# EAGLE design PidiPC (EAGLE 9.2.0)
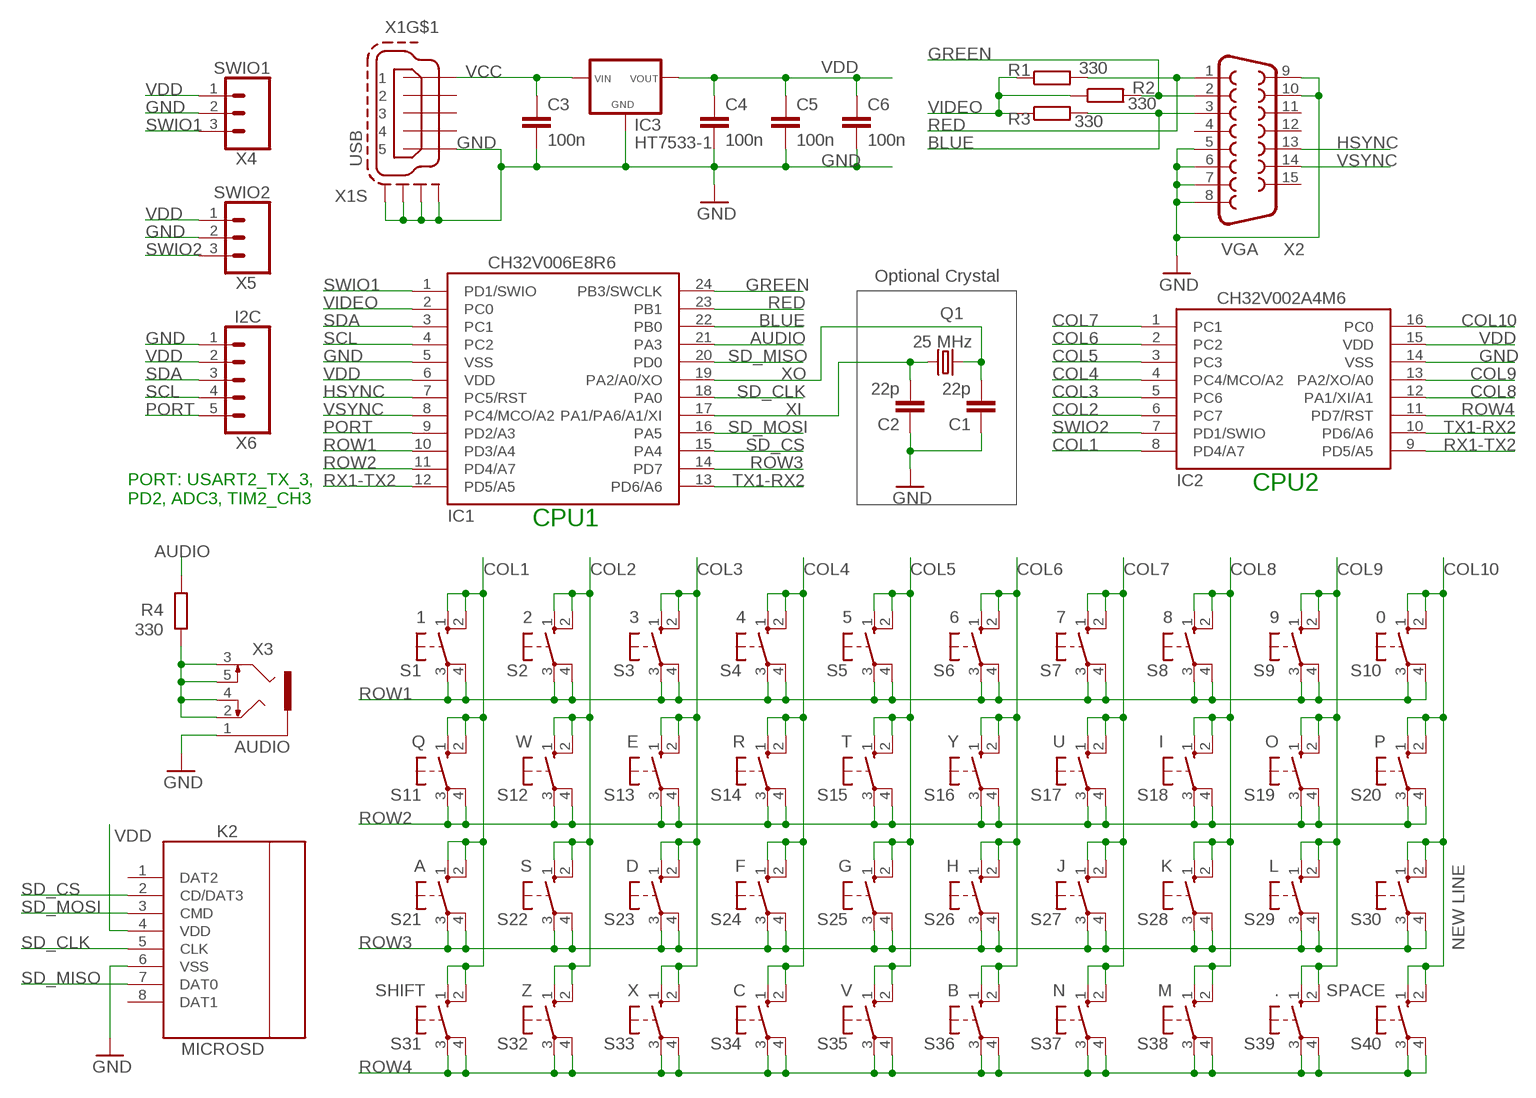
[diagram p0: schematic, sheet 1]

## Parts
C1  22p  C-EU050-024X044  [C050-024X044]
C2  22p  C-EU050-024X044  [C050-024X044]
C3  100n  C-EU050-024X044  [C050-024X044]
C4  100n  C-EU050-024X044  [C050-024X044]
C5  100n  C-EU050-024X044  [C050-024X044]
C6  100n  C-EU050-024X044  [C050-024X044]
IC1  CH32V006E8R6  [QSOP24]
IC2  CH32V002A4M6  [SOP16]
IC3  HT7533-1  [HT7533-1]
K2  MICROSD  [MICROSD]
Q1  25 MHz  CRYSTALHC49U-V  [HC49U-V]
R1  330  R-EU_0204/7  [0204/7]
R2  330  R-EU_0204/7  [0204/7]
R3  330  R-EU_0204/7  [0204/7]
R4  330  R-EU_0204/7  [0204/7]
S1  1  10-XX  [B3F-10XX]
S2  2  10-XX  [B3F-10XX]
S3  3  10-XX  [B3F-10XX]
S4  4  10-XX  [B3F-10XX]
S5  5  10-XX  [B3F-10XX]
S6  6  10-XX  [B3F-10XX]
S7  7  10-XX  [B3F-10XX]
S8  8  10-XX  [B3F-10XX]
S9  9  10-XX  [B3F-10XX]
S10  0  10-XX  [B3F-10XX]
S11  Q  10-XX  [B3F-10XX]
S12  W  10-XX  [B3F-10XX]
S13  E  10-XX  [B3F-10XX]
S14  R  10-XX  [B3F-10XX]
S15  T  10-XX  [B3F-10XX]
S16  Y  10-XX  [B3F-10XX]
S17  U  10-XX  [B3F-10XX]
S18  I  10-XX  [B3F-10XX]
S19  O  10-XX  [B3F-10XX]
S20  P  10-XX  [B3F-10XX]
S21  A  10-XX  [B3F-10XX]
S22  S  10-XX  [B3F-10XX]
S23  D  10-XX  [B3F-10XX]
S24  F  10-XX  [B3F-10XX]
S25  G  10-XX  [B3F-10XX]
S26  H  10-XX  [B3F-10XX]
S27  J  10-XX  [B3F-10XX]
S28  K  10-XX  [B3F-10XX]
S29  L  10-XX  [B3F-10XX]
S30  NEW LINE  10-XX  [B3F-10XX]
S31  SHIFT  10-XX  [B3F-10XX]
S32  Z  10-XX  [B3F-10XX]
S33  X  10-XX  [B3F-10XX]
S34  C  10-XX  [B3F-10XX]
S35  V  10-XX  [B3F-10XX]
S36  B  10-XX  [B3F-10XX]
S37  N  10-XX  [B3F-10XX]
S38  M  10-XX  [B3F-10XX]
S39  .  10-XX  [B3F-10XX]
S40  SPACE  10-XX  [B3F-10XX]
X1  USB  MINI-USB-SCHIELD-32005-201  [32005-201]
X2  VGA  F15HDH  [HDF15H]
X3  AUDIO  1503_09  [1503_09]
X4  SWIO1  CONN_03LONGPADS  [1X03_LONGPADS]
X5  SWIO2  CONN_03LONGPADS  [1X03_LONGPADS]
X6  I2C  CONN_05PTH_LONGPADS  [1X05_LONGPADS]

## Nets
AUDIO: IC1.21(PA3) R4.2
BLUE: IC1.22(PB0) R3.2 X2.3
COL1: IC2.8(PD4/A7) S1.1(S) S1.2(S1) S11.1(S) S11.2(S1) S21.1(S) S21.2(S1) S31.1(S) S31.2(S1)
COL2: IC2.6(PC7) S2.1(S) S2.2(S1) S12.1(S) S12.2(S1) S22.1(S) S22.2(S1) S32.1(S) S32.2(S1)
COL3: IC2.5(PC6) S3.1(S) S3.2(S1) S13.1(S) S13.2(S1) S23.1(S) S23.2(S1) S33.1(S) S33.2(S1)
COL4: IC2.4(PC4/MCO/A2) S4.1(S) S4.2(S1) S14.1(S) S14.2(S1) S24.1(S) S24.2(S1) S34.1(S) S34.2(S1)
COL5: IC2.3(PC3) S5.1(S) S5.2(S1) S15.1(S) S15.2(S1) S25.1(S) S25.2(S1) S35.1(S) S35.2(S1)
COL6: IC2.2(PC2) S6.1(S) S6.2(S1) S16.1(S) S16.2(S1) S26.1(S) S26.2(S1) S36.1(S) S36.2(S1)
COL7: IC2.1(PC1) S7.1(S) S7.2(S1) S17.1(S) S17.2(S1) S27.1(S) S27.2(S1) S37.1(S) S37.2(S1)
COL8: IC2.12(PA1/XI/A1) S8.1(S) S8.2(S1) S18.1(S) S18.2(S1) S28.1(S) S28.2(S1) S38.1(S) S38.2(S1)
COL9: IC2.13(PA2/XO/A0) S9.1(S) S9.2(S1) S19.1(S) S19.2(S1) S29.1(S) S29.2(S1) S39.1(S) S39.2(S1)
COL10: IC2.16(PC0) S10.1(S) S10.2(S1) S20.1(S) S20.2(S1) S30.1(S) S30.2(S1) S40.1(S) S40.2(S1)
GND: C1.1 C2.1 C3.2 C4.2 C5.2 C6.2 IC1.5(VSS) IC2.14(VSS) IC3.GND K2.6(VSS) X1.5 X1.M1(S:S1) X1.M2(S:S2) X1.M3(S:S3) X1.M4(S:S4) X2.5 X2.6 X2.7 X2.8 X2.9 X2.10 X3.1 X4.2 X5.2 X6.1
GREEN: IC1.24(PB3/SWCLK) R2.2 X2.2
HSYNC: IC1.7(PC5/RST) X2.13
N$7: R4.1 X3.2 X3.3 X3.4 X3.5
PORT: IC1.9(PD2/A3) X6.5
RED: IC1.23(PB1) R1.2 X2.1
ROW1: IC1.10(PD3/A4) S1.3(P) S1.4(P1) S2.3(P) S2.4(P1) S3.3(P) S3.4(P1) S4.3(P) S4.4(P1) S5.3(P) S5.4(P1) S6.3(P) S6.4(P1) S7.3(P) S7.4(P1) S8.3(P) S8.4(P1) S9.3(P) S9.4(P1) S10.3(P) S10.4(P1)
ROW2: IC1.11(PD4/A7) S11.3(P) S11.4(P1) S12.3(P) S12.4(P1) S13.3(P) S13.4(P1) S14.3(P) S14.4(P1) S15.3(P) S15.4(P1) S16.3(P) S16.4(P1) S17.3(P) S17.4(P1) S18.3(P) S18.4(P1) S19.3(P) S19.4(P1) S20.3(P) S20.4(P1)
ROW3: IC1.14(PD7) S21.3(P) S21.4(P1) S22.3(P) S22.4(P1) S23.3(P) S23.4(P1) S24.3(P) S24.4(P1) S25.3(P) S25.4(P1) S26.3(P) S26.4(P1) S27.3(P) S27.4(P1) S28.3(P) S28.4(P1) S29.3(P) S29.4(P1) S30.3(P) S30.4(P1)
ROW4: IC2.11(PD7/RST) S31.3(P) S31.4(P1) S32.3(P) S32.4(P1) S33.3(P) S33.4(P1) S34.3(P) S34.4(P1) S35.3(P) S35.4(P1) S36.3(P) S36.4(P1) S37.3(P) S37.4(P1) S38.3(P) S38.4(P1) S39.3(P) S39.4(P1) S40.3(P) S40.4(P1)
RX1-TX2: IC1.12(PD5/A5) IC2.9(PD5/A5)
SCL: IC1.4(PC2) X6.4
SD_CLK: IC1.18(PA0) K2.5(CLK)
SD_CS: IC1.15(PA4) K2.2(CD/DAT3)
SD_MISO: IC1.20(PD0) K2.7(DAT0)
SD_MOSI: IC1.16(PA5) K2.3(CMD)
SDA: IC1.3(PC1) X6.3
SWIO1: IC1.1(PD1/SWIO) X4.3
SWIO2: IC2.7(PD1/SWIO) X5.3
TX1-RX2: IC1.13(PD6/A6) IC2.10(PD6/A6)
VCC: C3.1 IC3.VIN X1.1
VDD: C4.1 C5.1 C6.1 IC1.6(VDD) IC2.15(VDD) IC3.VOUT K2.4(VDD) X4.1 X5.1 X6.2
VIDEO: IC1.2(PC0) R1.1 R2.1 R3.1
VSYNC: IC1.8(PC4/MCO/A2) X2.14
XI: C2.2 IC1.17(PA1/PA6/A1/XI) Q1.2
XO: C1.2 IC1.19(PA2/A0/XO) Q1.1
Unconnected: K2.1(DAT2) K2.8(DAT1) X1.2 X1.3 X1.4 X2.4 X2.11 X2.12 X2.15

## Notes on the sheet
- Optional Crystal
- CPU2
- PORT: USART2_TX_3,
  PD2, ADC3, TIM2_CH3
- CPU1

## Library data of the parts
C1-C6 = rcl:C-EU: CAPACITOR, European symbol; SPICEPREFIX: C
IC1 = CH32V:CH32V006E8R6
IC2 = CH32V:CH32V002A4M6
IC3 = HT7533-1B:HT7533-1
K2 = Wuerth_Elektronik_eiCan_Communication_Connectors_v2.2:MICROSD: WR-CRD MICRO SD CARD CONNECTOR HINGE 8PINS
Q1 = crystal:CRYSTAL: CRYSTAL; OC_FARNELL: 1666969; OC_NEWARK: unknown
R1-R4 = rcl:R-EU_: RESISTOR, European symbol; SPICEPREFIX: R
S1-S40 = switch-omron2:10-XX: OMRON SWITCH; MPN: B3F-1000; OC_FARNELL: 176432; OC_NEWARK: 36M3542
X1 = con-cypressindustries:MINI-USB-SCHIELD-: MINI USB-B Conector Source: www.cypressindustries.com; OC_FARNELL: unknown; OC_NEWARK: unknown
X2 = adafruit_B:F15: SUB-D HDH is also known as a 'right angle VGA' connector
X3 = con-lumberg:1503_09: Jack connectors according to JISC 6560, 3.5 mm Klinkeneinbaukupplung nach JISC 6560, 3,5 mm, 3-polig/ stereo, abgewinkelte Ausführung, mit 2 Öffnern und Lötaugen, für Leiterplatten Rückseitenmontage Source: http://www.lumberg.com/Produkte/PDFs/1503_09.pdf; OC_FARNELL: 1243244; OC_NEWARK: unknown
X4 X5 = SparkFun-Connectors:CONN_03: Multi connection point. Often used as Generic Header-pin footprint for 0.1 inch spaced/style header connections On any of the 0.1 inch spaced packages, you can populate with these: Break Away Headers - Straight <https://www.sparkfun.com/products/116> (PRT-00116) Break Away Male Headers - Right Angle <https://www.sparkfun.com/products/553> (PRT-00553) Female Headers <https://www.sparkfun.com/products/115> (PRT-00115) Break Away Headers - Machine Pin <https://www.sparkfun.com/products/117> (PRT-00117) Break Away Female Headers - Swiss Machine Pin <https://www.sparkfun.com/products/743> (PRT-00743) Stackable Header - 3 Pin (Female, 0.1") <https://www.sparkfun.com/products/13875> (PRT-13875) For SCREWTERMINALS and SPRING TERMINALS visit here: Screw Terimnals on SparkFun.com <https://www.sparkfun.com/search/results?term=Screw+Terminals> (5mm/3.5mm/2.54mm spacing) This device is also useful as a general connection point to wire up your design to another part of your project. Our various solder wires solder well into these plated through hole pads. Hook-Up Wire - Assortment (Stranded, 22 AWG) <https://www.sparkfun.com/products/11375> (PRT-11375) Hook-Up Wire - Assortment (Solid Core, 22 AWG) <https://www.sparkfun.com/products/11367> (PRT-11367) View the entire wire category on our website here <https://www.sparkfun.com/categories/141> Special notes: Molex polarized connector foot print use with SKU : PRT-08232 with associated crimp pins and housings.
X6 = SparkFun-Connectors:CONN_05: Multi connection point. Often used as Generic Header-pin footprint for 0.1 inch spaced/style header connections On any of the 0.1 inch spaced packages, you can populate with these: Break Away Headers - Straight <https://www.sparkfun.com/products/116> (PRT-00116) Break Away Male Headers - Right Angle <https://www.sparkfun.com/products/553> (PRT-00553) Female Headers <https://www.sparkfun.com/products/115> (PRT-00115) Break Away Headers - Machine Pin <https://www.sparkfun.com/products/117> (PRT-00117) Break Away Female Headers - Swiss Machine Pin <https://www.sparkfun.com/products/743> (PRT-00743) For SCREWTERMINALS and SPRING TERMINALS visit here: Screw Terimnals on SparkFun.com <https://www.sparkfun.com/search/results?term=Screw+Terminals> (5mm/3.5mm/2.54mm spacing) This device is also useful as a general connection point to wire up your design to another part of your project. Our various solder wires solder well into these plated through hole pads. Hook-Up Wire - Assortment (Stranded, 22 AWG) <https://www.sparkfun.com/products/11375> (PRT-11375) Hook-Up Wire - Assortment (Solid Core, 22 AWG) <https://www.sparkfun.com/products/11367> (PRT-11367) View the entire wire category on our website here <https://www.sparkfun.com/categories/141> Special notes: Molex polarized connector foot print use with SKU : PRT-08231 with associated crimp pins and housings. 1MM SMD Version SKU: PRT-10208

## Board
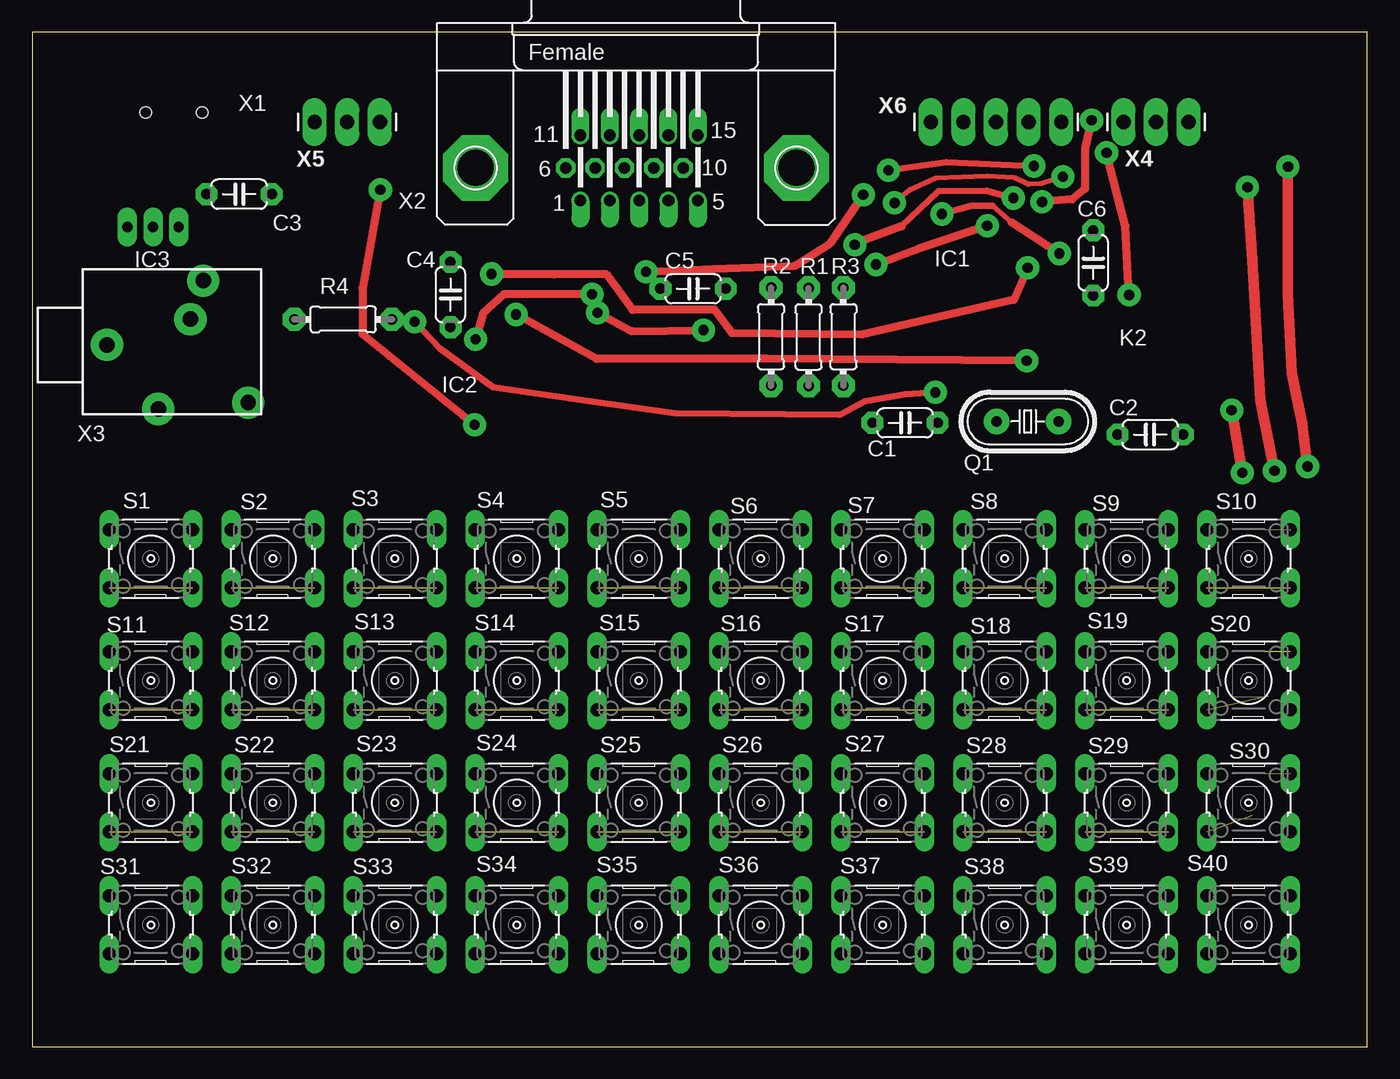
[diagram p1: board, top side]
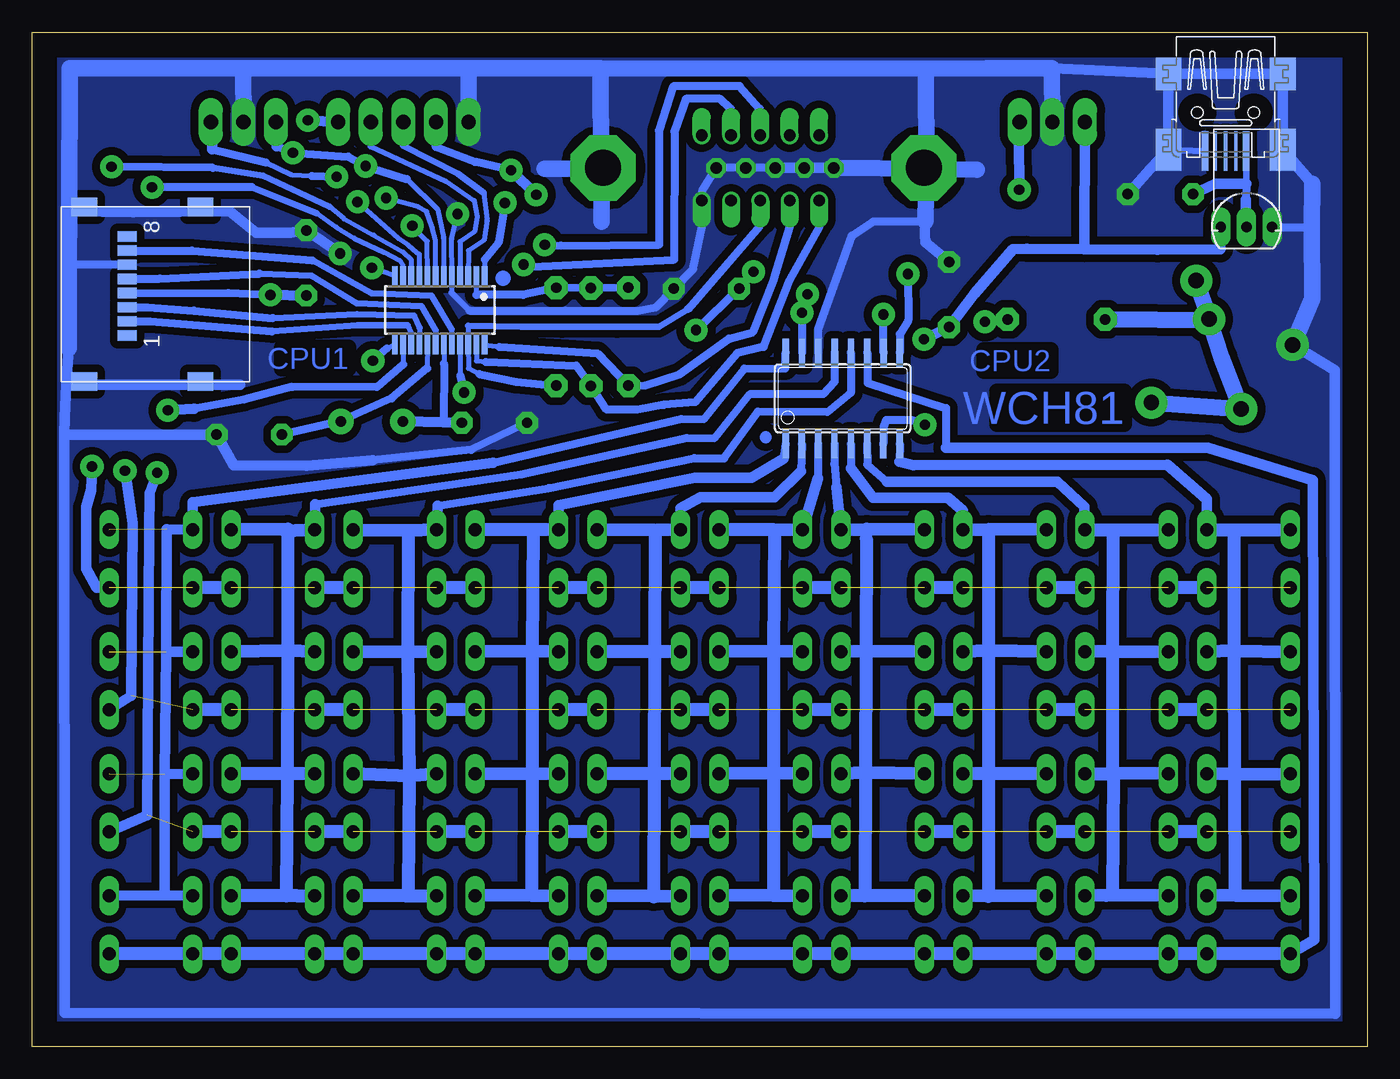
[diagram p2: board, bottom side, seen from below]

Size 104 x 79 mm. Coordinates in mm from the lower left corner, seen from the top.
Outline: 0,0 104,0 104,79 0,79 0,0
Copper layers (1*16): Top 0.035mm / dielectric 1.5mm / Bottom 0.035mm
Design rules "default": minimum track width 6mil, minimum drill 0.35mm, track to track 6mil, track to pad 6mil, pad to pad 6mil, via to via 6mil, smd to smd 6mil, copper to edge 40mil, drill to drill 6mil, minimum pad ring 10mil, minimum via ring 8mil, stop-mask expansion 4mil, vias tented up to drill 0mil, thermal gap 10mil

### Footprints (pad centres in the part's own frame; a part is rotated, then mirrored left to right if it is on the bottom)
C050-024X044 = drill 0.813 pad 1.7 octagon: 1 -2.54,0; 2 2.54,0
QSOP24 = smd 0.45 x 1.5: 1 -3.493,-2.69; 2 -2.857,-2.69; 3 -2.223,-2.69; 4 -1.587,-2.69; 5 -0.953,-2.69; 6 -0.318,-2.69; 7 0.318,-2.69; 8 0.953,-2.69; 9 1.587,-2.69; 10 2.223,-2.69; 11 2.857,-2.69; 12 3.493,-2.69; 13 3.493,2.69; 14 2.857,2.69; 15 2.223,2.69; 16 1.587,2.69; 17 0.953,2.69; 18 0.318,2.69; 19 -0.318,2.69; 20 -0.953,2.69; 21 -1.587,2.69; 22 -2.223,2.69; 23 -2.857,2.69; 24 -3.493,2.69
SOP16 = smd 0.5 x 2.2: 1 -4.445,-3.55; 2 -3.185,-3.55; 3 -1.915,-3.55; 4 -0.645,-3.55; 5 0.635,-3.55; 6 1.895,-3.55; 7 3.165,-3.55; 8 4.435,-3.55; 9 4.445,3.55; 10 3.175,3.55; 11 1.905,3.55; 12 0.635,3.55; 13 -0.635,3.55; 14 -1.905,3.55; 15 -3.175,3.55; 16 -4.445,3.55
HT7533-1 = drill 0.8 pad 1.5 long: GND 2,0; VIN 0,0; VOUT -2,0
MICROSD = smd 0.8 x 1.5: 1 2.62,-2.54; 2 1.52,-2.54; 3 0.42,-2.54; 4 -0.68,-2.54; 5 -1.78,-2.54; 6 -2.88,-2.54; 7 -3.98,-2.54; 8 -5.08,-2.54 | smd 1.45 x 2: Z1 -7.38,3.16; Z2 6.22,3.16; Z3 -7.38,-5.89; Z4 6.22,-5.89
HC49U-V = drill 0.813 pad 2: 1 -2.413,0; 2 2.413,0
0204/7 = drill 0.813 pad 1.8 octagon: 1 -3.81,0; 2 3.81,0
B3F-10XX = drill 1.016 long: 1 -3.251,2.261; 2 3.251,2.261; 3 -3.251,-2.261; 4 3.251,-2.261
32005-201 = smd 3.1 x 0.5: 1 3,1.6; 5 3,-1.6 | smd 3.1 x 0.254: 2 3,0.8; 3 3,0; 4 3,-0.8 | smd 2.5 x 2: M1 -3,-4.45; M2 -3,4.45 | smd 3.3 x 2: M3 2.9,4.45; M4 2.9,-4.45 | hole 0.9: 0,2.2; 0,-2.2
HDF15H = drill 0.9 pad 1.27 offset: 1 4.329,2.54; 2 2.043,2.54; 3 -0.243,2.54; 4 -2.529,2.54; 5 -4.815,2.54; 11 4.329,-2.54; 12 2.043,-2.54; 13 -0.243,-2.54; 14 -2.529,-2.54; 15 -4.815,-2.54 | drill 0.9 pad 1.5 octagon: 6 5.472,0; 7 3.186,0; 8 0.9,0; 9 -1.386,0; 10 -3.672,0 | drill 2.8 pad 5.08 octagon: P$1 -12.5,0; P$2 12.5,0
1503_09 = drill 1.2 pad 2.5: 1 0,-2; 2 -5,-6; 3 5,-9.5; 4 -4.5,-13; 5 2,-8.5
1X03_LONGPADS = drill 1.118 pad 1.88 long: 1 0,0; 2 2.54,0; 3 5.08,0
1X05_LONGPADS = drill 1.118 pad 1.88 long: 1 0,0; 2 2.54,0; 3 5.08,0; 4 7.62,0; 5 10.16,0

### Placement (x,y rotation side)
C1  67.99,48.58 0 top
C2  87.09,47.67 180 top
C3  16.12,66.39 0 top
C4  32.58,58.57 90 top
C5  51.48,59.02 0 top
C6  82.64,61.03 90 top
IC1  72.26,57.35 180 bottom
IC2  40.86,50.49 0 bottom
IC3  9.42,63.82 0 bottom
K2  94.05,58.01 270 bottom
Q1  77.54,48.69 0 top
R1  60.47,55.26 270 top
R2  57.55,55.29 270 top
R3  63.19,55.29 270 top
R4  24.23,56.64 0 top
S1  9.25,38 0 top
S2  18.75,38 0 top
S3  28.25,38 0 top
S4  37.75,38 0 top
S5  47.25,38 0 top
S6  56.75,38 0 top
S7  66.25,38 0 top
S8  75.75,38 0 top
S9  85.25,38 0 top
S10  94.75,38 0 top
S11  9.25,28.5 0 top
S12  18.75,28.5 0 top
S13  28.25,28.5 0 top
S14  37.75,28.5 0 top
S15  47.25,28.5 0 top
S16  56.75,28.5 0 top
S17  66.25,28.5 0 top
S18  75.75,28.5 0 top
S19  85.25,28.5 0 top
S20  94.75,28.5 0 top
S21  9.25,19 0 top
S22  18.75,19 0 top
S23  28.25,19 0 top
S24  37.75,19 0 top
S25  47.25,19 0 top
S26  56.75,19 0 top
S27  66.25,19 0 top
S28  75.75,19 0 top
S29  85.25,19 0 top
S30  94.75,19 0 top
S31  9.25,9.5 0 top
S32  18.75,9.5 0 top
S33  28.25,9.5 0 top
S34  37.75,9.5 0 top
S35  47.25,9.5 0 top
S36  56.75,9.5 0 top
S37  66.25,9.5 0 top
S38  75.75,9.5 0 top
S39  85.25,9.5 0 top
S40  94.75,9.5 0 top
X1  11.04,72.74 270 bottom
X2  47.04,68.43 180 top
X3  3.83,54.65 90 top
X4  85,72 0 top
X5  22,72 0 top
X6  70,72 0 top

### Tracks (layer width: path | path; a pad name or v marks a point on that pad's centre or on a via)
AUDIO  (via drill 0.8 pad 1.8)
  Top 0.508: v70.35,50.95 68.02,50.79 64.87,50.26 62.94,49.19 50.08,49.32 43.45,50.26 35.88,51.35 31.74,54.4 v29.79,56.46
  Bottom 0.406: IC1.21 70.66,52.27
  Bottom 0.508: v29.79,56.46 R4.2
  Bottom 0.61: 70.66,52.27 v70.35,50.95
BLUE
  Bottom 0.406: 69.16,52.37 70.02,52.83 IC1.22 70.05,56.15
  Bottom 0.508: 52.93,57.42 55.19,56.08 58.41,56.05 62.73,56.05 65.93,56.08 70.05,56.15
  Bottom 0.61: 69.16,52.37 66.29,51.76 R3.2 | X2.3 47.31,63.92 52.93,57.42
COL1
  Bottom 0.61: IC2.8 36.44,45.54
  Bottom 0.813: 36.44,45.54 35.38,45.28 15.59,45.31 12.49,42.62 S1.2
  Bottom 1.016: S1.2 10.41,40.25 | 10.41,40.25 10.41,30.83 | 10.41,30.83 10.38,21.23 | 10.38,21.23 10.33,11.8 | 10.33,11.8 S31.2 | 10.38,21.23 S21.2 | 10.41,30.83 S11.2 | 10.41,40.25 S1.1 | 10.41,30.83 S11.1 | 10.38,21.23 S21.1 | 10.33,11.8 S31.1
COL2
  Bottom 0.61: IC2.6 38.96,45.33 37.43,44.01 | 19.86,21.3 19.8,21.25 | 19.86,11.8 20.34,11.79 | 15.97,30.75 S12.1
  Bottom 0.813: 37.43,44.01 24.15,44.01 22.04,42.03 S2.2
  Bottom 1.016: S2.2 19.83,40.25 | 19.83,40.25 19.88,30.8 | 19.88,30.8 19.86,21.3 S22.1 | 19.86,11.8 19.8,21.25 S22.2 | S32.2 20.34,11.79 S32.1 | 19.88,30.8 S12.2 | 19.83,40.25 S2.1 | 19.88,30.8 15.97,30.75
COL3
  Bottom 0.61: IC2.5 40.23,45.03 | 31.49,40.99 S3.2
  Bottom 0.813: 40.23,45.03 38.5,42.74 32.68,42.74 31.49,41.73 31.49,40.99
  Bottom 1.016: S3.2 29.51,40.28 | 29.51,40.28 29.52,30.83 | 29.52,30.83 29.52,21.25 | 29.52,21.25 29.53,11.7 | 29.53,11.7 S33.2 | 29.52,21.25 S23.2 | 29.52,30.83 S13.2 | S33.1 29.53,11.7 | S23.1 29.52,21.25 | S13.1 29.52,30.83 | S3.1 29.51,40.28
COL4
  Bottom 0.61: IC2.4 41.52,45.38 41.34,43.58 | 38.98,40.3 39.03,39.57 | 39.11,21.33 39.09,21.33
  Bottom 0.813: 41.34,43.58 S4.2
  Bottom 1.016: S4.2 38.98,40.3 S4.1 | 39.03,39.57 39.06,30.78 | 39.06,30.78 39.11,21.33 S24.1 | 39.13,11.75 39.09,21.33 S24.2 | 39.13,11.75 S34.2 | 39.06,30.78 S14.2 | S14.1 39.06,30.78 | S34.1 39.13,11.75
COL5
  Bottom 0.61: IC2.3 42.79,44.27 | 46.25,40.23 46.2,40.25
  Bottom 0.813: 42.79,44.27 S5.1
  Bottom 1.016: S5.1 46.25,40.23 | 46.27,30.78 46.2,40.25 S5.2 | 46.27,30.78 46.27,21.3 | 46.27,21.3 46.27,11.78 | 46.27,11.78 S35.1 | S25.1 46.27,21.3 | S15.1 46.27,30.78 | 46.27,11.78 S35.2 | 46.27,21.3 S25.2 | 46.27,30.78 S15.2
COL6
  Bottom 0.61: IC2.2 44.11,44.8 | 55.42,40.2 55.47,40.2 | 55.59,11.68 55.24,11.72
  Bottom 0.813: 44.11,44.8 46.17,42.79 51.94,42.79 53.49,41.93 S6.1
  Bottom 1.016: S6.1 55.42,40.2 | 55.53,30.75 55.47,40.2 S6.2 | 55.53,30.75 55.58,21.26 | 55.58,21.26 55.59,11.68 | S36.1 55.24,11.72 S36.2 | S26.1 55.58,21.26 | S16.1 55.53,30.75 | 55.53,30.75 S16.2 | 55.58,21.26 S26.2
COL7
  Bottom 0.61: IC2.1 45.48,45.79
  Bottom 0.813: 45.48,45.79 47.97,44.32 52.37,44.29 62.98,42.16 S7.1
  Bottom 1.016: S7.1 64.99,40.25 | 64.99,40.25 65.04,30.78 | 65.04,30.78 65.04,21.23 | 65.04,21.23 65.09,11.78 | 65.09,11.78 S37.1 | S27.1 65.04,21.23 | S17.1 65.04,30.78 | 65.09,11.78 S37.2 | 65.04,21.23 S27.2 | 65.04,30.78 S17.2 | 64.99,40.25 S7.2
COL8
  Bottom 0.61: 72.41,42.13 63.77,43.5 52.44,45.84 50.11,45.81 47.47,49.45 42.06,49.42 40.23,50.92 IC2.12 | 74.72,11.98 74.97,11.78 | 78.35,40.23 S8.2
  Bottom 0.813: S8.1 72.41,42.13
  Bottom 1.016: S8.1 74.72,40.18 | 74.72,40.18 74.75,30.71 | 74.75,30.71 74.64,21.07 | 74.64,21.07 74.72,11.98 | S38.1 74.97,11.78 S38.2 | S28.1 74.64,21.07 | S18.1 74.75,30.71 | 74.72,40.18 78.35,40.23 | 74.75,30.71 S18.2 | 74.64,21.07 S28.2
COL9
  Bottom 0.61: 81.96,42.23 65.91,44.57 53,47.41 50.87,47.39 48.13,50.79 42.39,50.82 41.5,51.78 IC2.13 | 84.27,40.15 84.09,40.31 | 84.19,11.75 83.42,11.76
  Bottom 0.813: S9.1 81.96,42.23
  Bottom 1.016: S9.1 84.27,40.15 | 84.08,30.85 84.09,40.31 S9.2 | 84.08,30.85 84.13,21.27 | 84.13,21.27 84.19,11.75 | S39.1 83.42,11.76 S39.2 | S29.1 84.13,21.27 | S19.1 84.08,30.85 | 84.13,21.27 S29.2 | 84.08,30.85 S19.2
COL10  (3 unrouted)
  Bottom 0.61: 68.09,45.48 53.44,48.89 51.68,48.86 48.53,52.8 45.33,52.83 IC2.16
  Bottom 0.813: 68.09,45.48 91.48,42.39 S10.1 93.52,40.3 93.56,30.76 | 93.56,30.76 93.67,21.23 | 93.67,11.81 93.67,21.23 | S30.1 93.67,21.23 | S20.1 93.56,30.76 | S40.1 93.67,11.81 | 93.67,11.81 S40.2
GND  (via drill 0.8 pad 1.8)
  Top 0.406: 74.82,65.47 76.3,64.18
  Top 0.508: v70.86,64.84 73.14,65.5 74.82,65.47
  Top 0.61: 76.3,64.18 v80,61.77
  Bottom 0.406: v70.86,64.84 71.32,62.88 IC1.5 71.32,58.72
  Bottom 0.508: 71.32,58.72 69.94,57.32 | X1.M4 X1.5
  Bottom 0.61: C1.1 69.79,46.48 77.49,45.66 | IC2.14 42.77,55.9 40.15,63.16 38.47,64.25 34.44,64.28 | K2.6 101.14,60.88 | IC3.GND 4.32,63.8 | X2.8 X2.9 X2.10 51.81,66.59 X2.5 51.84,63.85 52.52,60.55 C5.2 55.42,57.58 56.86,57.3 62.48,57.32 69.94,57.32
  Bottom 0.813: 77.49,45.66 82.62,45.23 88.28,45.28 C2.1 101.49,47.64 | 34.44,64.28 34.46,63.24 34.44,62.66 C4.2 | X2.8 X2.7 X2.6 | X3.1 2.53,52.67 2.51,2.58 101.47,2.63 101.49,47.64 | 101.49,47.64 101.47,49.02 101.32,51.55 | 101.32,51.55 101.16,54.4 | 101.12,65.04 96.11,64.99 88.61,65.04 86.56,63.39 83.92,63.39 C6.2 v80,61.77 | 4.29,67.2 X1.M3 X1.M2 X1.M1 | C3.2 16.91,68.34 X1.M4 X1.M1 | 24.56,76.19 X1.M1 | 101.32,51.55 87.8,51.55
  Bottom 1.27: X6.1 70.02,76.19 | 70.02,76.19 87.58,76.19 | 87.58,76.19 101.08,76.19 101.12,65.04 101.14,60.88 101.16,54.4 | X4.2 87.58,76.19 | 70.02,76.19 59.73,76.19 | 59.73,76.19 34.38,76.14 | 34.38,76.14 29.69,76.17 24.56,76.19 X5.2 | 34.38,76.14 34.35,68.35 | 34.44,64.28 34.35,68.35 | 59.73,76.19 59.68,68.34 | 59.68,68.34 59.66,64.23 | X2.6 34.35,68.35 | 34.35,68.35 30.4,68.29 | 59.68,68.34 64.08,68.34 | X3.1 4.31,58.24 4.32,63.8 4.29,67.2
  pour Bottom (isolate 0.61, no thermals): 2,77 2,2 102,2 102,77
GREEN
  Bottom 0.406: IC1.24 67.61,54.5
  Bottom 0.61: 67.61,54.5 59.96,53.99 R2.2 56.23,51.51 53.56,52.37 49.73,55.14 47.87,55.65 46.22,59.76 44.98,63.85 X2.2
HSYNC  (via drill 0.8 pad 1.8)
  Top 0.508: v76.42,66.08 74.34,66.64 70.58,66.59 67.71,63.87 | 64.56,62.71 v64.08,62.45
  Top 0.61: 67.71,63.87 64.56,62.71
  Bottom 0.406: IC1.7 72.59,62.81 72.84,63.8 73.27,65.02 73.93,65.4 v76.42,66.08
  Bottom 0.61: X2.13 47.34,73.04 48.89,74.8 54.07,74.77 55.19,71.34 55.16,62.45 62.81,62.38 v64.08,62.45
N$7
  Bottom 0.508: 12.3,56.56 X3.5
  Bottom 1.27: X3.4 X3.2 11.37,53.69 12.3,56.56 R4.1 | X3.5 X3.3
PORT  (via drill 0.8 pad 1.8)
  Top 0.61: v82.52,72.13 82.01,69.92 82.01,66.8 80.99,65.98 v78.66,65.78
  Bottom 0.406: v78.66,65.78 75.46,62.94 74.72,62.43 74.34,62.1 73.86,61.72 IC1.9
  Bottom 0.813: X6.5 v82.52,72.13
RED
  Bottom 0.406: IC1.23 69.39,53.41 68.65,53.33
  Bottom 0.61: 68.65,53.33 61.61,53.03 R1.2 59.25,49.6 56.86,49.6 54.81,49.98 52.37,50.18 49.12,53.99 47.02,54.5 45,59.68 42.69,63.85 X2.1
ROW1  (via drill 0.8 pad 1.8)  (10 unrouted)
  Top 0.813: v97.81,68.52 97.78,58.59 98.11,52.44 98.93,48.48 v99.33,45.18
  Bottom 0.406: 80.84,65.4 79.7,64.46 77.39,63.19 75.08,61.87 74.49,61.33 IC1.10
  Bottom 0.508: 80.84,65.4 86.02,67.81 89.91,68.42
  Bottom 0.61: 89.91,68.42 v97.81,68.52
  Bottom 0.813: S10.4 98.98,35.73 99.79,37.2 99.79,42.01 99.4,43.38 v99.33,45.18
  Bottom 1.016: S1.4 S2.3 | S2.4 S3.3 | S3.4 S4.3 | S4.4 S5.3 | S5.4 S6.3 | S6.4 S7.3 | S7.4 S8.3 | S8.4 S9.3 | S9.4 S10.3
ROW2  (via drill 0.8 pad 1.8)  (10 unrouted)
  Top 0.813: v94.66,66.92 95.04,61.23 95.65,50.34 v96.77,44.85
  Bottom 0.406: 81.83,64.89 80.31,63.82 78.91,62.96 76.6,61.84 75.36,61.21 75.13,60.88 IC1.11
  Bottom 0.508: 81.83,64.89 86.89,66.92
  Bottom 0.61: 86.89,66.92 v94.66,66.92
  Bottom 0.813: S20.4 96.28,27.35 96.16,40.76 v96.77,44.85
  Bottom 1.016: S11.4 S12.3 | S12.4 S13.3 | S13.4 S14.3 | S14.4 S15.3 | S15.4 S16.3 | S16.4 S17.3 | S17.4 S18.3 | S18.4 S19.3 | S19.4 S20.3
ROW3  (via drill 0.8 pad 1.8)  (10 unrouted)
  Top 0.813: v93.42,49.55 v94.25,44.7
  Bottom 0.406: IC1.14 75.1,53.1
  Bottom 0.61: 75.1,53.1 77.13,51.35 83.74,51.38 87.52,50.39 91.38,49.68
  Bottom 0.813: S30.4 95.04,18.03 94.86,40.2 94.84,43.1 v94.25,44.7 | 91.38,49.68 v93.42,49.55
  Bottom 1.016: S21.4 S22.3 | S22.4 S23.3 | S23.4 S24.3 | S24.4 S25.3 | S25.4 S26.3 | S26.4 S27.3 | S27.4 S28.3 | S28.4 S29.3 | S29.4 S30.3
ROW4
  Bottom 0.61: IC2.11 38.93,51.68 32.81,49.73 32.81,46.65
  Bottom 0.813: 32.81,46.65 12.44,46.65 4.26,44.11 4.13,8.32 S31.3
  Bottom 1.016: S40.4 S40.3 S39.4 S39.3 S38.4 S38.3 S37.4 S37.3 S36.4 S36.3 S35.4 S35.3 S34.4 S34.3 S33.4 S33.3 S32.4 S32.3 S31.4 S31.3
RX1-TX2  (via drill 0.8 pad 1.8)
  Top 0.61: v77.54,60.65 76.45,58.16 64.61,55.44 54.5,55.57 53.13,57.4 46.76,57.37 44.72,60.14 40.68,60.14 37.99,60.17 v35.78,60.17
  Bottom 0.406: IC1.12 v77.54,60.65
  Bottom 0.61: v35.78,60.17 35.76,56.56 36.42,55.49 IC2.9
SCL
  Bottom 0.406: 77.62,70.1 71.77,67.41 69.56,65.88 69.33,64.64 69.54,63.47 70.68,62.68 IC1.4
  Bottom 0.508: X6.4 77.62,70.1
SD_CLK
  Bottom 0.406: 72.59,55.8 IC1.18
  Bottom 0.508: 86.28,60.19 82.21,60.04 78.71,57.91 73.65,57.65 72.59,55.8
  Bottom 0.61: K2.5 94.05,59.81 86.28,60.19
SD_CS
  Bottom 0.406: 74.77,56.18 74.47,55.54 IC1.15
  Bottom 0.508: 85.31,55.7 78.63,56.18 74.77,56.18
  Bottom 0.61: K2.2 94.81,56.48 85.31,55.7
SD_MISO
  Bottom 0.406: 71.32,55.85 IC1.20
  Bottom 0.508: 82.16,61.23 77.54,58.67 72.87,58.46 71.32,55.85
  Bottom 0.61: K2.7 91.53,61.99 82.16,61.23
SD_MOSI
  Bottom 0.406: 73.83,56 IC1.16
  Bottom 0.508: 85.24,56.74 78.68,57.02 74.24,56.91 73.83,56
  Bottom 0.61: K2.3 95.02,57.58 91.41,57.32 85.24,56.74
SDA
  Bottom 0.406: 68.83,66.49 68.57,64.38 68.8,62.81 70.02,61.99 IC1.3
  Bottom 0.508: X6.3 75.1,70.15 70.81,67.96 68.83,66.49
SWIO1  (via drill 0.8 pad 1.8)
  Top 0.406: v80.28,67.73 78.56,67.2 77.56,67.15 76.52,67.66 74.36,67.79 70.38,67.63 68.34,66.67 v67.18,65.7
  Bottom 0.406: 85.8,68.85 83.79,67.91 82.21,67.81 | 68.75,61.28 IC1.1
  Bottom 0.61: 89.99,69.87 85.8,68.85 | 82.21,67.81 v80.28,67.73 | v67.18,65.7 67.68,62.6 68.75,61.28
  Bottom 0.813: 89.99,69.87 89.99,71.16 X4.3
SWIO2  (via drill 0.8 pad 1.8)
  Top 0.61: v27.12,66.72 25.72,59.07 25.72,55.49 v34.46,48.43
  Bottom 0.61: IC2.7 37.69,48.23 37.48,48.79 35.48,48.79 v34.46,48.43
  Bottom 0.813: v27.12,66.72 27.15,70.61 X5.3
TX1-RX2  (via drill 0.8 pad 1.8)
  Top 0.61: v77.46,53.41 57.22,53.59 43.96,53.56 v37.69,57.02
  Bottom 0.406: IC1.13 76.37,54.35
  Bottom 0.61: IC2.10 v37.69,57.02 | 76.37,54.35 v77.46,53.41
VCC
  Bottom 0.508: X1.1 9.44,67.18
  Bottom 0.61: 9.44,67.18 9.47,65.96
  Bottom 0.813: 9.47,65.96 IC3.VIN | C3.1 11.83,67.18 9.44,67.18
VDD  (via drill 0.8 pad 1.8)
  Top 0.508: v78.03,68.57 71.22,68.85 v66.69,68.24
  Top 0.61: v85.44,58.54 85.16,63.9 v83.69,69.61 | v43.6,58.59 36.75,58.59 35.12,57.09 v34.54,55.09 | v44.04,57.14 46.68,55.72 v52.29,55.8 | v47.82,60.34 53.08,60.57 59.4,60.83 62.17,62.58 v64.74,66.34
  Bottom 0.406: 74.8,67.56 72.43,65.19 71.95,62.98 IC1.6
  Bottom 0.61: K2.4 88.69,58.69 v85.44,58.54 | 74.8,67.56 v78.03,68.57 79.37,69.31 v83.69,69.61 84.96,70.12 | X6.2 72.56,70.07 69.51,68.9 v66.69,68.24 | v52.29,55.8 C5.1 48.23,59.84 v47.82,60.34 | v43.6,58.59 v44.04,57.14 IC2.15
  Bottom 0.813: 22.04,62.1 16.35,62.07 11.47,62.09 IC3.VOUT | 22.04,62.1 X5.1 | 22.04,62.1 26.51,62.12 27.6,62.1 30.6,58.62 C4.1 v34.54,55.09 | 84.96,70.12 X4.1 | C6.1 v85.44,58.54 | v64.74,66.34 v66.69,68.24
VIDEO
  Bottom 0.406: 69.39,58.54 69.39,59.56 IC1.2
  Bottom 0.61: R2.1 R1.1 R3.1 65.75,58.54 69.39,58.54
VSYNC  (via drill 0.8 pad 1.8)
  Top 0.61: v74.39,63.92 69.03,62.12 v65.73,60.9
  Bottom 0.406: IC1.8 73.22,62.73 v74.39,63.92
  Bottom 0.61: X2.14 49.6,73.04 50.41,73.81 53.08,73.81 53.97,71.27 53.99,61.28 65.09,60.73 v65.73,60.9
XI
  Bottom 0.406: IC1.17 73.22,52.83
  Bottom 0.61: C2.2 Q1.2 75.99,50.49 73.22,52.83
XO
  Bottom 0.406: IC1.19 71.93,53.18
  Bottom 0.61: 71.93,53.18 71.95,48.62
  Bottom 0.813: Q1.1 71.95,48.62 C1.2
(copper drawn outside any net)
  shapes: Bottom circle x2

### Text on the board
Bottom: CPU2 | CPU1 | WCH81
Document: GND | PORT | GND | SDA | GND | VCC | SWIO2 | VCC | SCL | VCC | SWIO1